# Altium schematic sheet Wall Thermostat.SchDoc: Thermostat Relay Circuit
size A; Author: Liam Robinson; DrawnBy: Liam Robinson; DocumentNumber: 1; Revision: 1.0; SheetNumber: 1; SheetTotal: 1
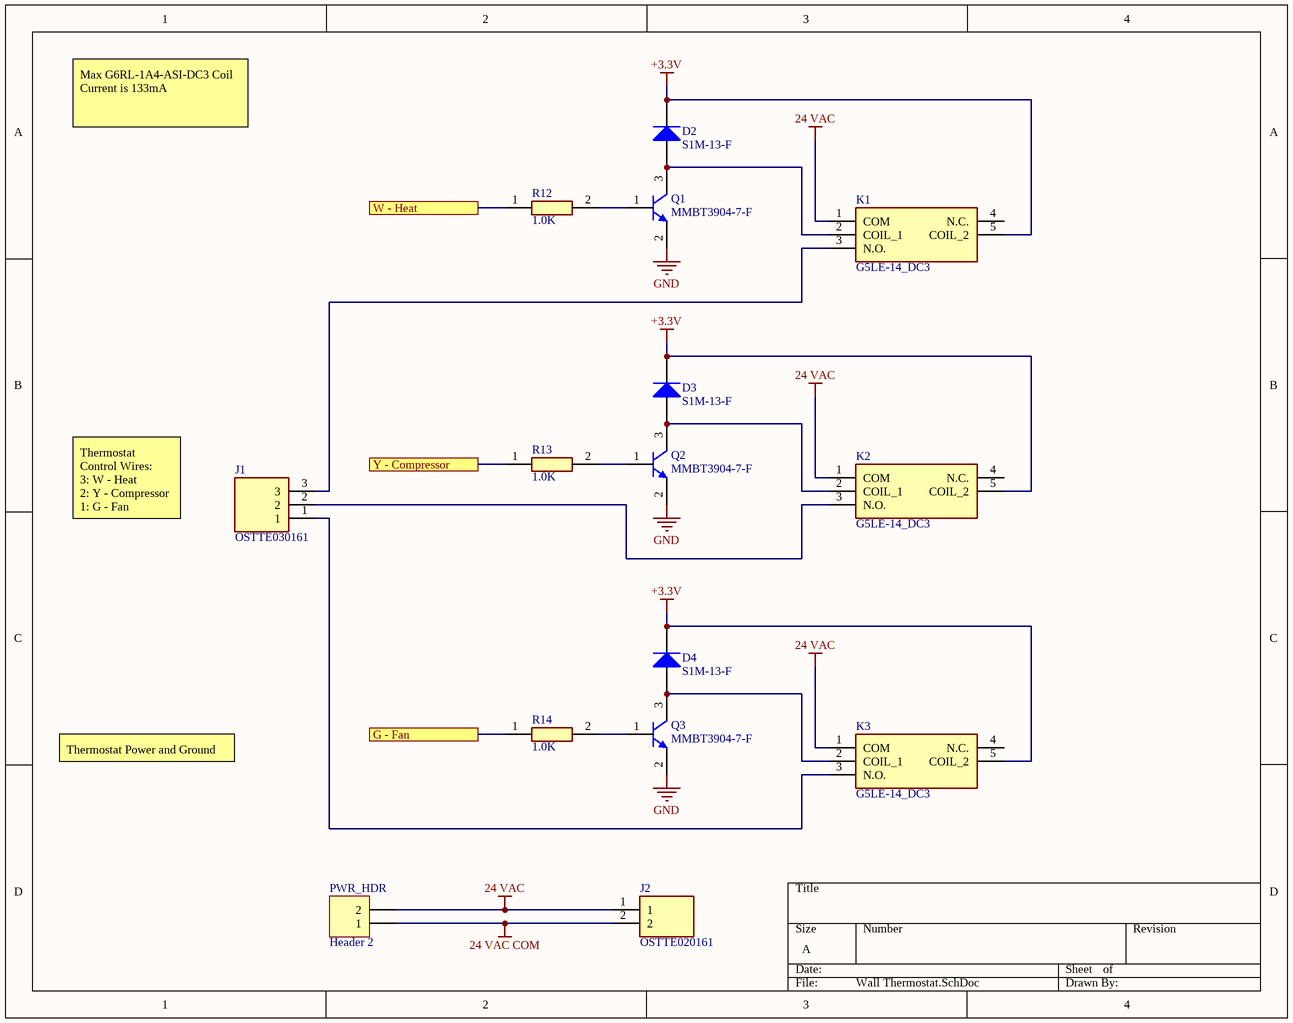
[diagram p0: Wall Thermostat.SchDoc]

## Parts
D2  S1M-13-F  [DIOD-S1M-13-F-SMA-2_V]
D3  S1M-13-F  [DIOD-S1M-13-F-SMA-2_V]
D4  S1M-13-F  [DIOD-S1M-13-F-SMA-2_V]
J1  OSTTE030161  [SHDR3W90P0X350_1X3_1150X700X840P]
J2  OSTTE020161  [SHDR2W90P0X350_1X2_800X700X855P]
K1  G5LE-14_DC3  [G5LE-14_SPDT]
K2  G5LE-14_DC3  [G5LE-14_SPDT]
K3  G5LE-14_DC3  [G5LE-14_SPDT]
PWR_HDR  Header 2  [HDR1X2]
Q1  MMBT3904-7-F  [DIOD-SOT23-3_V]
Q2  MMBT3904-7-F  [DIOD-SOT23-3_V]
Q3  MMBT3904-7-F  [DIOD-SOT23-3_V]
R12  1.0K  [RESC2012X60N]
R13  1.0K  [RESC2012X60N]
R14  1.0K  [RESC2012X60N]

## Ports
G - Fan, W - Heat, Y - Compressor

## Nets
24 VAC: J2.1 K1.1(COM) K2.1(COM) K3.1(COM) PWR_HDR.2
24 VAC COM: J2.2 PWR_HDR.1
+3.3V: D2.2(K) D3.2(K) D4.2(K) K1.5(COIL_2) K2.5(COIL_2) K3.5(COIL_2)
GND: Q1.2(E) Q2.2(E) Q3.2(E)
G - Fan: R14.1 ; port G - Fan
W - Heat: R12.1 ; port W - Heat
Y - Compressor: R13.1 ; port Y - Compressor
NetD2_1: D2.1(A) K1.2(COIL_1) Q1.3(C)
NetD3_1: D3.1(A) K2.2(COIL_1) Q2.3(C)
NetD4_1: D4.1(A) K3.2(COIL_1) Q3.3(C)
NetJ1_1: J1.1 K3.3(N.O.)
NetJ1_2: J1.2 K2.3(N.O.)
NetJ1_3: J1.3 K1.3(N.O.)
NetQ1_1: Q1.1(B) R12.2
NetQ2_1: Q2.1(B) R13.2
NetQ3_1: Q3.1(B) R14.2

Not connected (* = marked no-connect by the designer): K1 4(N.C.); K2 4(N.C.); K3 4(N.C.)

## Notes on the sheet
- Max G6RL-1A4-ASI-DC3 Coil Current is 133mA
- Thermostat Control Wires:
  3: W - Heat
  2: Y - Compressor
  1: G - Fan
- Thermostat Power and Ground

## Library data of the parts
D2-D4 = CMP-0639-00001-1: Surface Mount Glass Passivated Rectifier, 1000V, 1 A, -65 to 125 degC, 2-Pin SMA Package, RoHS, Tape and Reel; Manufacturer: Diodes Inc; Maximum Reverse Current IR (uA): 5; Maximum Peak Forward Surge Current IFSM (A): 30; Maximum Average Rectified Current IO (A): 1; Peak Repetitive Reverse Voltage VRRM (V): 1000; Total Capacitance CT (pF): 10; Forward Voltage Drop VF (V): 1.1; ComponentLink1URL: http://www.diodes.com/; Operating Temperature Range: -65 to 150 degC; ComponentLink3URL: http://diodes.com/datasheets/ds16003.pdf; ComponentLink3Description: Package Specification; PackageDescription: 2-Pin SMD, Body 4.3 x 2.605 mm, Height 2.3 mm; Mounting Technology: Surface Mount; ComponentLink1Description: Manufacturer URL; PackageReference: S1M-13-F-SMA-2; ComponentLink2URL: http://diodes.com/datasheets/ds16003.pdf; ComponentLink2Description: Datasheet; RoHS: TRUE; DatasheetVersion: Rev. 22 - 2; Packing: Tape and Reel; PackageVersion: Rev. 22 - 2; PartNumber: S1M-13-F
J1 = OSTTE030161: Connector; Manufacturer_Name: On-Shore Technology; Datasheet Link: https://www.arrow.com/en/products/ostte030161/on-shore-technology; Height: 8.4mm; Manufacturer_Part_Number: OSTTE030161; Arrow Part Number: OSTTE030161; Arrow Price/Stock: https://www.arrow.com/en/products/ostte030161/on-shore-technology
J2 = OSTTE020161: Connector; Manufacturer_Name: On-Shore Technology; Datasheet Link: http://www.on-shore.com/wp-content/uploads/OSTTEXX0161.pdf; Height: 8.55mm; Manufacturer_Part_Number: OSTTE020161; Arrow Part Number: OSTTE020161; Arrow Price/Stock: https://www.arrow.com/en/products/ostte020161/on-shore-technology
K1-K3 = G5LE-14_DC3: Relay or Contactor; Manufacturer_Name: Omron Electronics; Manufacturer_Part_Number: G5LE-14 DC3; Datasheet Link: https://omronfs.omron.com/en_US/ecb/products/pdf/en-g5le.pdf; Arrow Part Number: G5LE-14 DC3; Mouser Part Number: 653-G5LE-14DC3; Mouser Price/Stock: https://www.mouser.com/Search/Refine.aspx?Keyword=653-G5LE-14DC3
PWR_HDR = Header 2: Header, 2-Pin; LatestRevisionDate: 17-Jul-2002; LatestRevisionNote: Re-released for DXP Platform.; Publisher: Altium Limited
Q1-Q3 = CMP-2000-04931-1: NPN Small Signal Transistor, 40 V, 0.2 A, -55 to 150 degC, 3-Pin SOT23, RoHS, Tape and Reel; Manufacturer: DiodesIncorporated; Maximum DC Collector Current: 0.2A; Collector- Base Voltage VCBO: 60V; Collector- Emitter Voltage VCEO Max: 40V; Unit Weight: 0.000282oz; Emitter- Base Voltage VEBO: 6V; DC Collector/Base Gain hfe Min: 100; Collector-Emitter Saturation Voltage: 0.3V; Gain Bandwidth Product fT: 300MHz; DC Current Gain hFE Max: 300; Configuration: Single; Pd - Power Dissipation: 310mW; Series: MMBT3904; Width: 1.4mm; Package / Case: SOT-23; Mounting Style: SMD/SMT; Datasheet Version: Rev. 21-2, 11/2013; Package Reference: SOT23-3; Product Category: BipolarTransistors-BJT; Manufacturer URL: http://www.diodes.com/; Packaging: Reel; Brand: DiodesIncorporated; Package Description: 3-Pin Small Outline Transistor, Body 2.9 x 1.3 mm, Pitch 0.96 mm; Datasheet URL: http://download.siliconexpert.com/pdfs/2013/11/16/3/45/37/668/dds_/manual/1692ds30036.pdf; Height: 1mm; Maximum Operating Temperature: +150C; Factory Pack Quantity: 3000; Minimum Operating Temperature: -55C; Length: 3.05mm; Transistor Polarity: NPN; Continuous Collector Current: 0.2A; RoHS: True
R12-R14 = RC0805JR-071KL: Resistor; Manufacturer_Name: YAGEO (PHYCOMP); Datasheet Link: http://www.yageo.com/documents/recent/PYu-RC_Group_51_RoHS_L_10.pdf; Height: 0.6mm; Manufacturer_Part_Number: RC0805JR-071KL; Arrow Part Number: RC0805JR-071KL; Arrow Price/Stock: https://www.arrow.com/en/products/rc0805jr-071kl/yageo; Mouser Part Number: 603-RC0805JR-071KL; Mouser Price/Stock: https://www.mouser.co.uk/ProductDetail/Yageo/RC0805JR-071KL?qs=KyGMWp10UkuwbpWNcSKeOA%3D%3D